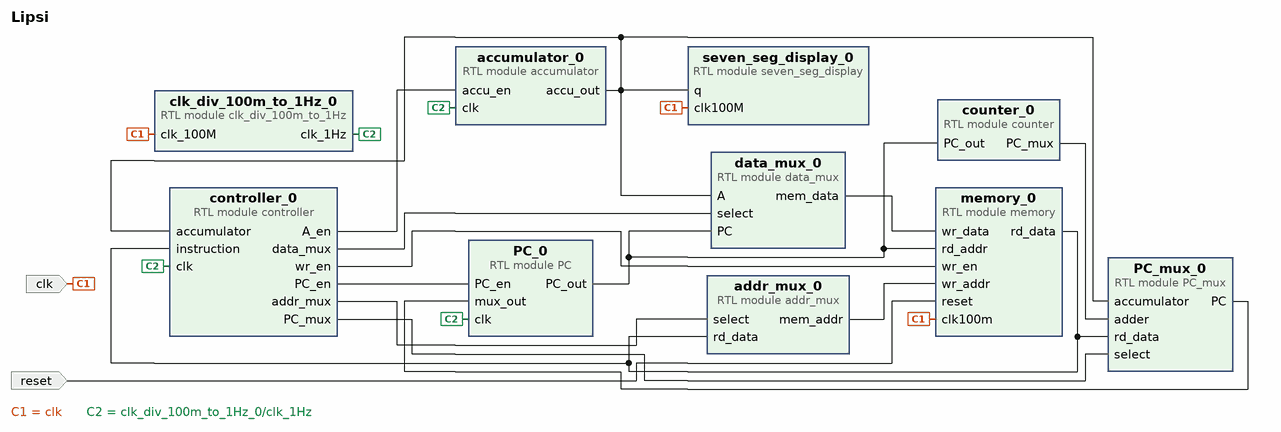
[diagram p0: block diagram of the top level]
# Vivado block design Lipsi, xc7a35tcpg236-1, Vivado 2023.2
create_bd_design Lipsi

create_bd_port -dir I clk
create_bd_port -dir I reset

create_bd_cell -type module -reference PC PC_0
create_bd_cell -type module -reference PC_mux PC_mux_0
create_bd_cell -type module -reference accumulator accumulator_0
create_bd_cell -type module -reference addr_mux addr_mux_0
create_bd_cell -type module -reference counter counter_0
create_bd_cell -type module -reference data_mux data_mux_0
create_bd_cell -type module -reference memory memory_0
create_bd_cell -type module -reference controller controller_0
create_bd_cell -type module -reference seven_seg_display seven_seg_display_0
create_bd_cell -type module -reference clk_div_100m_to_1Hz clk_div_100m_to_1Hz_0

# ---- connections ----

connect_bd_net [get_bd_ports clk] \
  [get_bd_pins clk_div_100m_to_1Hz_0/clk_100M] [get_bd_pins seven_seg_display_0/clk100M] [get_bd_pins memory_0/clk100m]
connect_bd_net [get_bd_pins PC_0/PC_out] [get_bd_pins memory_0/rd_addr] [get_bd_pins data_mux_0/PC] [get_bd_pins counter_0/PC_out]
connect_bd_net [get_bd_pins PC_mux_0/PC] [get_bd_pins PC_0/mux_out]
connect_bd_net [get_bd_pins accumulator_0/accu_out] \
  [get_bd_pins seven_seg_display_0/q] [get_bd_pins data_mux_0/A] [get_bd_pins controller_0/accumulator] \
  [get_bd_pins PC_mux_0/accumulator]
connect_bd_net [get_bd_pins addr_mux_0/mem_addr] [get_bd_pins memory_0/wr_addr]
connect_bd_net [get_bd_pins clk_div_100m_to_1Hz_0/clk_1Hz] [get_bd_pins PC_0/clk] [get_bd_pins controller_0/clk] [get_bd_pins accumulator_0/clk]
connect_bd_net [get_bd_pins controller_0/A_en] [get_bd_pins accumulator_0/accu_en]
connect_bd_net [get_bd_pins controller_0/PC_en] [get_bd_pins PC_0/PC_en]
connect_bd_net [get_bd_pins controller_0/PC_mux] [get_bd_pins PC_mux_0/select]
connect_bd_net [get_bd_pins controller_0/addr_mux] [get_bd_pins addr_mux_0/select]
connect_bd_net [get_bd_pins controller_0/data_mux] [get_bd_pins data_mux_0/select]
connect_bd_net [get_bd_pins controller_0/wr_en] [get_bd_pins memory_0/wr_en]
connect_bd_net [get_bd_pins counter_0/PC_mux] [get_bd_pins PC_mux_0/adder]
connect_bd_net [get_bd_pins data_mux_0/mem_data] [get_bd_pins memory_0/wr_data]
connect_bd_net [get_bd_pins memory_0/rd_data] [get_bd_pins addr_mux_0/rd_data] [get_bd_pins PC_mux_0/rd_data] [get_bd_pins controller_0/instruction]
connect_bd_net [get_bd_ports reset] [get_bd_pins memory_0/reset]

validate_bd_design
save_bd_design
